# EAGLE schematic emitter_follower (EAGLE 6.4)
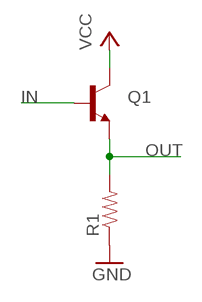
[diagram p0: schematic, sheet 1]

## Parts
Q1  TRANSISTOR_NPN"  [SOT223]
R1  RESISTOR  [0603RES]

## Nets
GND: R1.1
IN: Q1.1(B)
OUT: Q1.3(E) R1.2
VCC: Q1.2(C)

## Library data of the parts
Q1 = SparkFun-DiscreteSemi:TRANSISTOR_NPN: Generic NPN BJT. MMBT2222 is the common NPN we use. Double check against datasheet- not all devices are the same!
R1 = Ava:RESISTOR